# Altium schematic sheet Top.SchDoc
size A4; Organization: TESLA Motors, INC; Address1: 3500 Deer Creek Road; Address2: Palo Alto, CA; Address4: U.S.A.; SheetNumber: 1; SheetTotal: 13
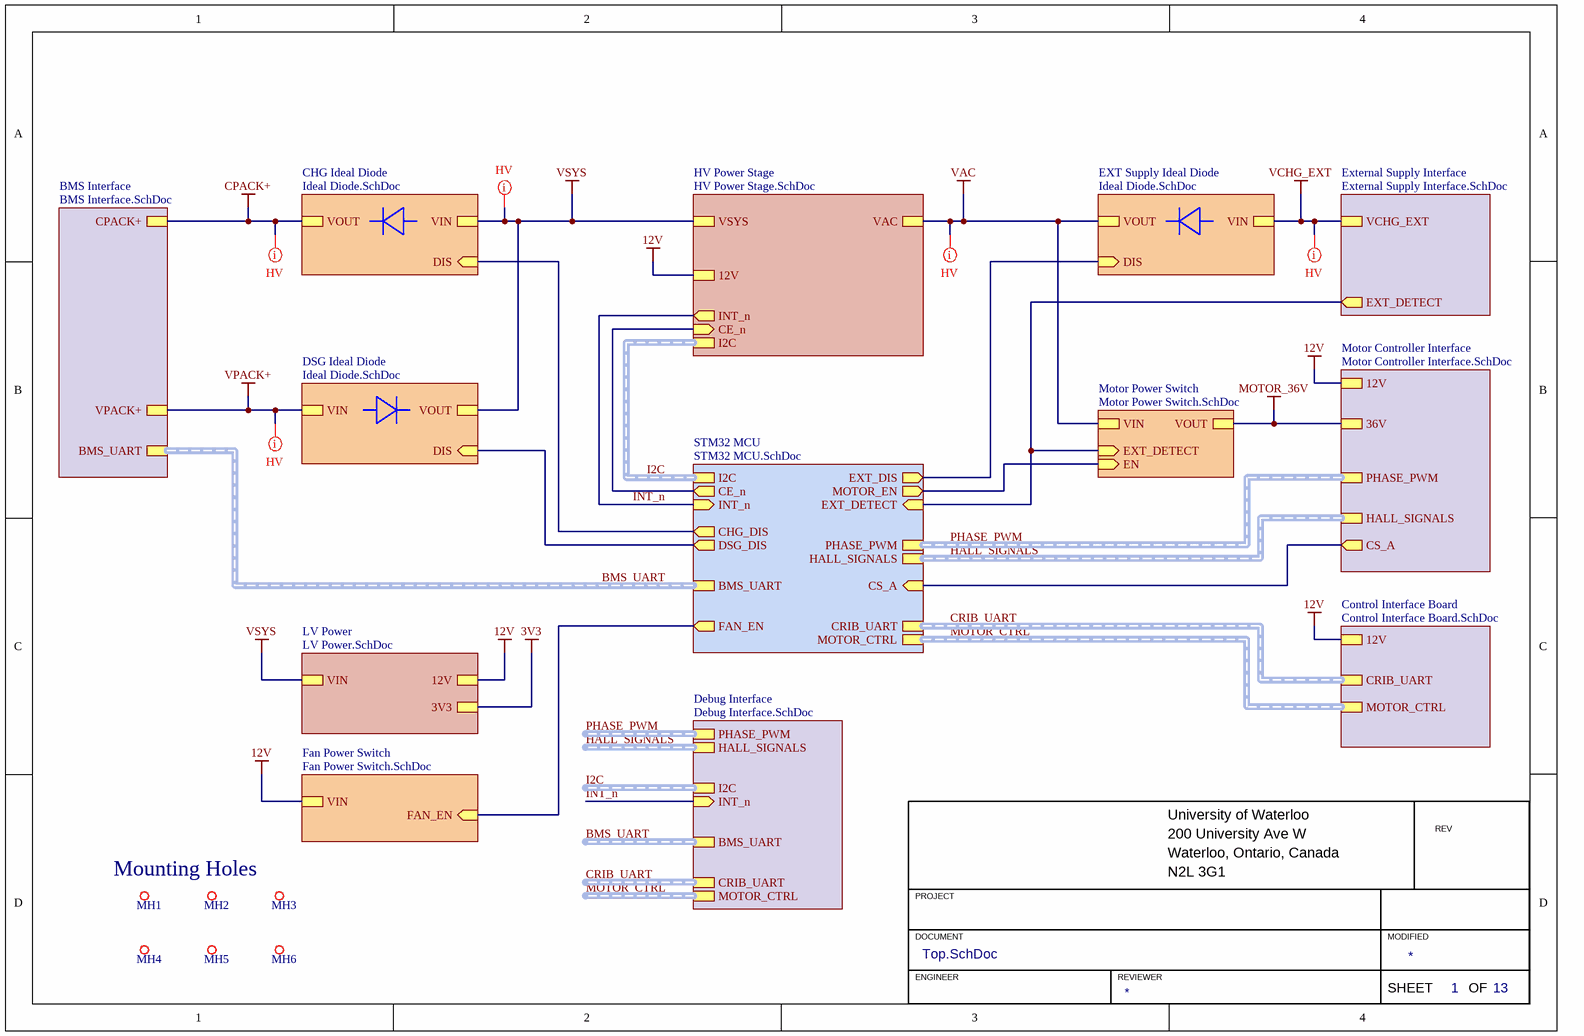
[diagram p0: Top.SchDoc]

## Parts
MH1  MOUNTING_HOLE_M3  [MOUNTING_HOLE_3mm]  (value not drawn)  (no BOM)
MH2  MOUNTING_HOLE_M3  [MOUNTING_HOLE_3mm]  (value not drawn)  (no BOM)
MH3  MOUNTING_HOLE_M3  [MOUNTING_HOLE_3mm]  (value not drawn)  (no BOM)
MH4  MOUNTING_HOLE_M3  [MOUNTING_HOLE_3mm]  (value not drawn)  (no BOM)
MH5  MOUNTING_HOLE_M3  [MOUNTING_HOLE_3mm]  (value not drawn)  (no BOM)
MH6  MOUNTING_HOLE_M3  [MOUNTING_HOLE_3mm]  (value not drawn)  (no BOM)

## Sub-sheets
BMS Interface = BMS Interface.SchDoc: BMS_UART (harness UART), VPACK+, CPACK+
CHG Ideal Diode = Ideal Diode.SchDoc: VOUT, VIN, DIS (in)
Control Interface Board = Control Interface Board.SchDoc: CRIB_UART (harness UART), MOTOR_CTRL (harness MOTOR CTRL), 12V
Debug Interface = Debug Interface.SchDoc: BMS_UART (harness UART), CRIB_UART (harness UART), I2C (harness I2C), HALL_SIGNALS (harness HALL SIGNALS), PHASE_PWM (harness PHASE PWM), MOTOR_CTRL (harness MOTOR CTRL), INT_n (in)
DSG Ideal Diode = Ideal Diode.SchDoc: VOUT, VIN, DIS (in)
EXT Supply Ideal Diode = Ideal Diode.SchDoc: VOUT, VIN, DIS (in)
External Supply Interface = External Supply Interface.SchDoc: VCHG_EXT, EXT_DETECT (out)
Fan Power Switch = Fan Power Switch.SchDoc: VIN, FAN_EN (in)
HV Power Stage = HV Power Stage.SchDoc: VSYS, VAC, 12V, INT_n (out), I2C (harness I2C), CE_n (in)
LV Power = LV Power.SchDoc: VIN, 12V, 3V3
Motor Controller Interface = Motor Controller Interface.SchDoc: 36V, 12V, CS_A (out), PHASE_PWM (harness PHASE PWM), HALL_SIGNALS (harness HALL SIGNALS)
Motor Power Switch = Motor Power Switch.SchDoc: VIN, VOUT, EN (in), EXT_DETECT (in)
STM32 MCU = STM32 MCU.SchDoc: HALL_SIGNALS (harness HALL SIGNALS), PHASE_PWM (harness PHASE PWM), CS_A (in), BMS_UART (harness UART), MOTOR_EN (out), EXT_DIS (out), I2C (harness I2C), CE_n (out), INT_n (in), CHG_DIS (out), DSG_DIS (out), CRIB_UART (harness UART), EXT_DETECT (in), MOTOR_CTRL (harness MOTOR CTRL), FAN_EN (out)

## Nets
3V3: sheet LV Power/3V3
12V: sheet Motor Controller Interface/12V, sheet LV Power/12V, sheet HV Power Stage/12V, sheet Control Interface Board/12V, sheet Fan Power Switch/VIN
CPACK+: sheet CHG Ideal Diode/VOUT, sheet BMS Interface/CPACK+
MOTOR_36V: sheet Motor Controller Interface/36V, sheet Motor Power Switch/VOUT
VAC: sheet EXT Supply Ideal Diode/VOUT, sheet Motor Power Switch/VIN, sheet HV Power Stage/VAC
VCHG_EXT: sheet EXT Supply Ideal Diode/VIN, sheet External Supply Interface/VCHG_EXT
VPACK+: sheet DSG Ideal Diode/VIN, sheet BMS Interface/VPACK+
VSYS: sheet CHG Ideal Diode/VIN, sheet DSG Ideal Diode/VOUT, sheet LV Power/VIN, sheet HV Power Stage/VSYS
INT_n: sheet HV Power Stage/INT_n, sheet STM32 MCU/INT_n, sheet Debug Interface/INT_n
(unnamed): sheet CHG Ideal Diode/DIS, sheet STM32 MCU/CHG_DIS
(unnamed): sheet DSG Ideal Diode/DIS, sheet STM32 MCU/DSG_DIS
(unnamed): sheet EXT Supply Ideal Diode/DIS, sheet STM32 MCU/EXT_DIS
(unnamed): sheet Motor Controller Interface/CS_A, sheet STM32 MCU/CS_A
(unnamed): sheet Motor Power Switch/EN, sheet STM32 MCU/MOTOR_EN
(unnamed): sheet Motor Power Switch/EXT_DETECT, sheet STM32 MCU/EXT_DETECT, sheet External Supply Interface/EXT_DETECT
(unnamed): sheet HV Power Stage/CE_n, sheet STM32 MCU/CE_n
(unnamed): sheet STM32 MCU/FAN_EN, sheet Fan Power Switch/FAN_EN

## Buses and harness runs
harness BMS_UART = sheet BMS Interface/BMS_UART = sheet STM32 MCU/BMS_UART
harness BMS_UART = sheet Debug Interface/BMS_UART
harness CRIB_UART = sheet Control Interface Board/CRIB_UART = sheet STM32 MCU/CRIB_UART
harness CRIB_UART = sheet Debug Interface/CRIB_UART
harness HALL_SIGNALS = sheet Debug Interface/HALL_SIGNALS
harness HALL_SIGNALS = sheet Motor Controller Interface/HALL_SIGNALS = sheet STM32 MCU/HALL_SIGNALS
harness I2C = sheet Debug Interface/I2C
harness I2C = sheet HV Power Stage/I2C = sheet STM32 MCU/I2C
harness MOTOR_CTRL = sheet Control Interface Board/MOTOR_CTRL = sheet STM32 MCU/MOTOR_CTRL
harness MOTOR_CTRL = sheet Debug Interface/MOTOR_CTRL
harness PHASE_PWM = sheet Debug Interface/PHASE_PWM
harness PHASE_PWM = sheet Motor Controller Interface/PHASE_PWM = sheet STM32 MCU/PHASE_PWM

## Layout directives
net class HV: CPACK+, VAC, VCHG_EXT, VPACK+, VSYS

## Notes on the sheet
- University of Waterloo
- 200 University Ave W
- REV
- Mounting Holes
- PROJECT
- Waterloo, Ontario, Canada
- N2L 3G1
- DOCUMENT
- ENGINEER
- REVIEWER
- MODIFIED
- SHEET
- OF